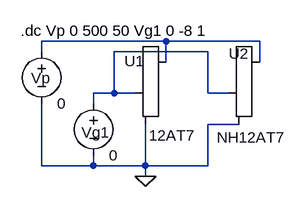
[diagram p0: schematic CompareTriodCar.asc]
CompareTriodCar.asc, the LTspice schematic file:
Version 4
SHEET 1 880 680
WIRE 48 112 -144 112
WIRE 192 112 48 112
WIRE -144 128 -144 112
WIRE 112 128 -32 128
WIRE 48 144 48 112
WIRE 192 144 192 112
WIRE -32 192 -32 128
WIRE -32 192 -64 192
WIRE 0 192 -32 192
WIRE 112 192 112 128
WIRE 144 192 112 192
WIRE -64 208 -64 192
WIRE 160 240 112 240
WIRE -144 304 -144 208
WIRE -64 304 -64 288
WIRE -64 304 -144 304
WIRE 16 304 16 240
WIRE 16 304 -64 304
WIRE 112 304 112 240
WIRE 112 304 16 304
WIRE 16 320 16 304
FLAG 16 320 0
SYMBOL voltage -144 112 R0
WINDOW 0 -16 57 Left 0
SYMATTR InstName Vp
SYMATTR Value 0
SYMBOL voltage -64 192 R0
WINDOW 0 -18 61 Left 0
SYMATTR InstName Vg1
SYMATTR Value 0
SYMBOL Valve\\triode 48 192 R0
WINDOW 0 -64 -49 Left 0
WINDOW 38 9 65 Center 0
SYMATTR InstName U1
SYMATTR SpiceModel 12AT7
SYMBOL Valve\\triode 192 192 R0
WINDOW 0 -47 -61 Left 0
WINDOW 38 -13 68 Center 0
SYMATTR InstName U2
SYMATTR SpiceModel NH12AT7
TEXT -176 96 Left 0 !.dc Vp 0 500 50 Vg1 0 -8 1

The netlist it stands for:
* CompareTriodCar.asc
Vp N001 0 0
Vg1 N002 0 0
XU1 N001 N002 0 12AT7
XU2 N001 N002 0 NH12AT7
.dc Vp 0 500 50 Vg1 0 -8 1
.backanno
.end